# Altium schematic sheet 交通灯.SCHDOC
size A4
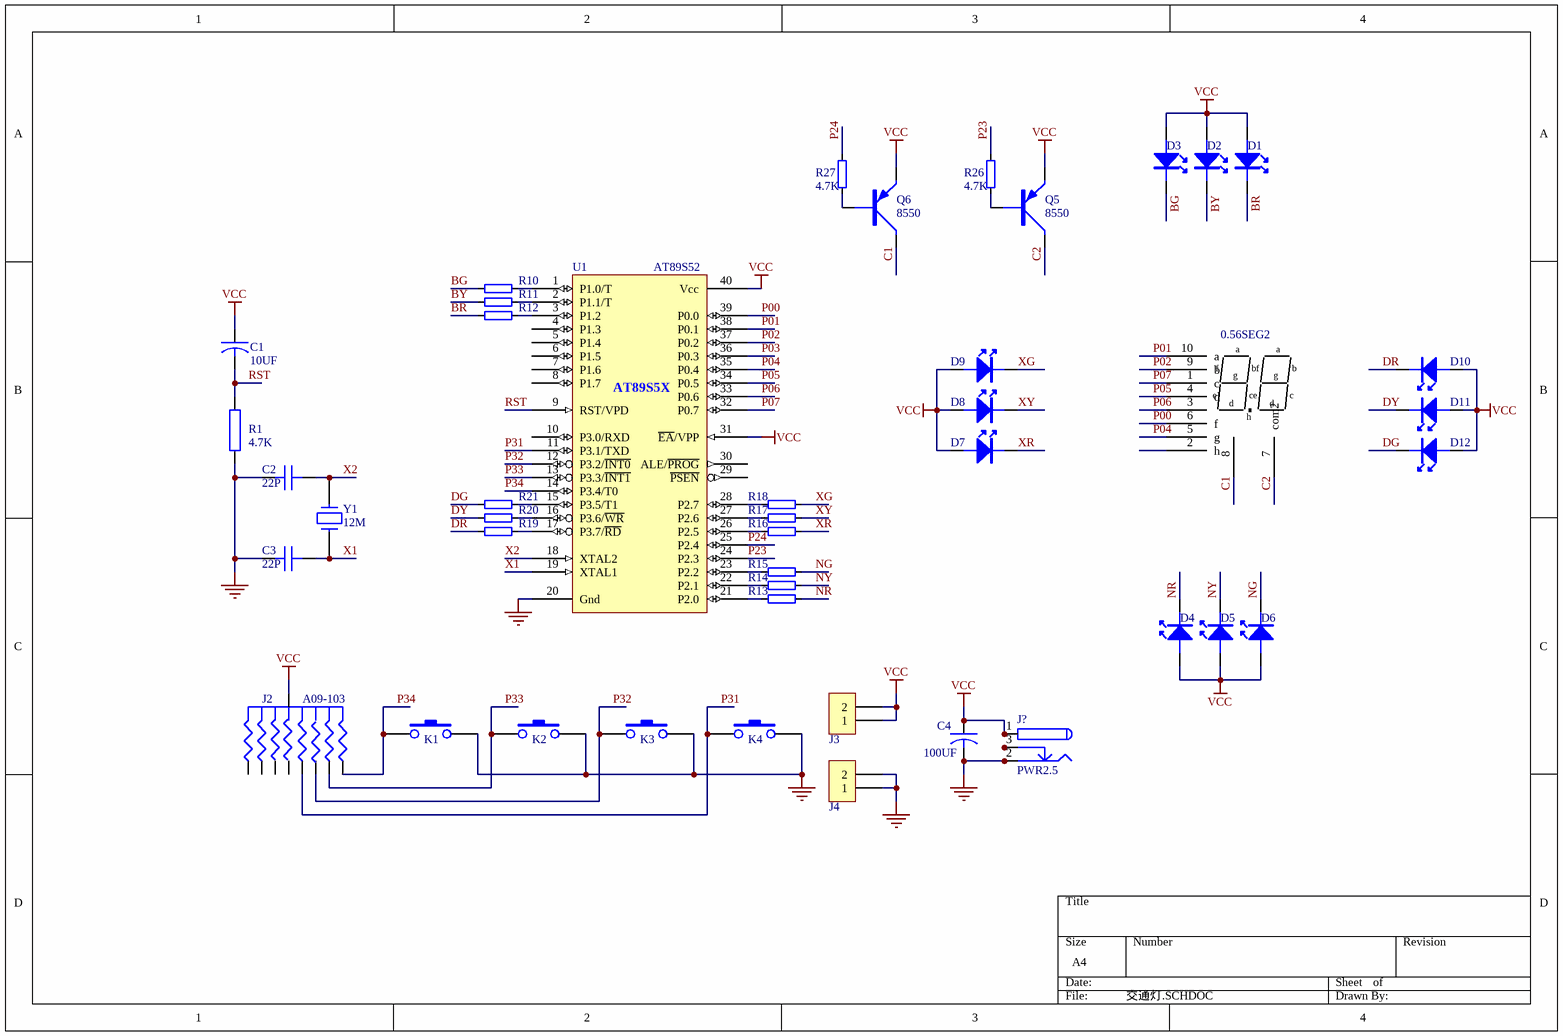
[diagram p0: 交通灯.SCHDOC]

## Parts
0.56SEG2  LED-2NUMBER  [LEDDIP-18ANUM]  (value not drawn)
C1  CAPACITOR  [CAPPA14.05-10.5x6.3]  (value not drawn)
C2  CAP  [CAPR5.08-7.8x3.2]  (value not drawn)
C3  CAP  [CAPR5.08-7.8x3.2]  (value not drawn)
C4  CAPACITOR  [CAPPA14.05-10.5x6.3]  (value not drawn)
D1  LED  [LED-0]  (value not drawn)
D2  LED  [LED-0]  (value not drawn)
D3  LED  [LED-0]  (value not drawn)
D4  LED  [LED-0]  (value not drawn)
D5  LED  [LED-0]  (value not drawn)
D6  LED  [LED-0]  (value not drawn)
D7  LED  [LED-0]  (value not drawn)
D8  LED  [LED-0]  (value not drawn)
D9  LED  [LED-0]  (value not drawn)
D10  LED  [LED-0]  (value not drawn)
D11  LED  [LED-0]  (value not drawn)
D12  LED  [LED-0]  (value not drawn)
J2  A09-103  [SIP9]
J3  CON2  [AXIAL-0.3]  (value not drawn)
J4  CON2  [AXIAL-0.3]  (value not drawn)
J?  PWR2.5  [KLD-0202]
K1  SW-PB  [SPST-2]  (value not drawn)
K2  SW-PB  [SPST-2]  (value not drawn)
K3  SW-PB  [SPST-2]  (value not drawn)
K4  SW-PB  [SPST-2]  (value not drawn)
Q5  8550  [BCY-W3]
Q6  8550  [BCY-W3]
R1  RES  [AXIAL-0.3]  (value not drawn)
R10  RES  [AXIAL-0.3]  (value not drawn)
R11  RES  [AXIAL-0.3]  (value not drawn)
R12  RES  [AXIAL-0.3]  (value not drawn)
R13  RES  [AXIAL-0.3]  (value not drawn)
R14  RES  [AXIAL-0.3]  (value not drawn)
R15  RES  [AXIAL-0.3]  (value not drawn)
R16  RES  [AXIAL-0.3]  (value not drawn)
R17  RES  [AXIAL-0.3]  (value not drawn)
R18  RES  [AXIAL-0.3]  (value not drawn)
R19  RES  [AXIAL-0.3]  (value not drawn)
R20  RES  [AXIAL-0.3]  (value not drawn)
R21  RES  [AXIAL-0.3]  (value not drawn)
R26  RES  [AXIAL-0.3]  (value not drawn)
R27  RES  [AXIAL-0.3]  (value not drawn)
U1  AT89S52  [DIP40]
Y1  CRYSTAL  [R38]  (value not drawn)

## Nets
GND: C2.1 C3.1 C4.2 J4.1 J4.2 J?.2 J?.2A J?.2B K1.2 K2.2 K3.2 K4.2 R1.1 U1.20(Gnd)
VCC: C1.1 C4.1 D1.1 D2.1 D3.1 D4.1 D5.1 D6.1 D7.1 D8.1 D9.1 D10.1 D11.1 D12.1 J2.1 J3.1 J3.2 J?.1 J?.1A J?.1B Q5.1(E) Q6.1(E) U1.31(~{EA}/VPP) U1.40(Vcc)
BG: D3.2 R10.1
BR: D1.2 R12.1
BY: D2.2 R11.1
C1: 0.56SEG2.8(com1) Q6.3(C)
C2: 0.56SEG2.7(com2) Q5.3(C)
DG: D12.2 R21.1
DR: D10.2 R19.1
DY: D11.2 R20.1
NG: D6.2 R15.2
NR: D4.2 R13.2
NY: D5.2 R14.2
P00: 0.56SEG2.6(f) U1.39(P0.0)
P01: 0.56SEG2.10(a) U1.38(P0.1)
P02: 0.56SEG2.9(b) U1.37(P0.2)
P03: U1.36(P0.3)
P04: 0.56SEG2.5(g) U1.35(P0.4)
P05: 0.56SEG2.4(d) U1.34(P0.5)
P06: 0.56SEG2.3(e) U1.33(P0.6)
P07: 0.56SEG2.1(c) U1.32(P0.7)
P23: R26.2 U1.24(P2.3)
P24: R27.2 U1.25(P2.4)
P31: J2.6 K4.1 U1.11(P3.1/TXD)
P32: J2.7 K3.1 U1.12(P3.2/~{INT0})
P33: J2.8 K2.1 U1.13(P3.3/~{INT1})
P34: J2.9 K1.1 U1.14(P3.4/T0)
RST: C1.2 R1.2 U1.9(RST/VPD)
X1: C3.2 U1.19(XTAL1) Y1.1
X2: C2.2 U1.18(XTAL2) Y1.2
XG: D9.2 R18.2
XR: D7.2 R16.2
XY: D8.2 R17.2
NetJ?_3: J?.3 J?.3A J?.3B
NetQ5_2: Q5.2(B) R26.1
NetQ6_2: Q6.2(B) R27.1
NetR10_2: R10.2 U1.1(P1.0/T)
NetR11_2: R11.2 U1.2(P1.1/T)
NetR12_2: R12.2 U1.3(P1.2)
NetR13_1: R13.1 U1.21(P2.0)
NetR14_1: R14.1 U1.22(P2.1)
NetR15_1: R15.1 U1.23(P2.2)
NetR16_1: R16.1 U1.26(P2.5)
NetR17_1: R17.1 U1.27(P2.6)
NetR18_1: R18.1 U1.28(P2.7)
NetR19_2: R19.2 U1.17(P3.7/~{RD})
NetR20_2: R20.2 U1.16(P3.6/~{WR})
NetR21_2: R21.2 U1.15(P3.5/T1)

Not connected (* = marked no-connect by the designer): 0.56SEG2 2(h); J2 2 3 4 5; U1 4(P1.3) 5(P1.4) 6(P1.5) 7(P1.6) 8(P1.7) 10(P3.0/RXD) 29(~{PSEN}) 30(ALE/~{PROG})

## Notes on the sheet
- (in symbol CAP) 22P
- (in symbol CAPACITOR) 10UF; 100UF
- (in symbol CRYSTAL) 12M
- (in symbol RES) 4.7K

## Library data of the parts
C2 C3 = CAP: Capacitor，电容
J2 = RES-ROW: 排阻
J3 J4 = CON2: Connector
J? = PWR2.5: Low Voltage Power Supply Connector; Published: 17-Dec-2003; DatasheetDocument: 09-May-2002; Publisher: Altium Limited
Q5 Q6 = 8550: PNP Transistor
U1 = AT89S5X
Y1 = CRYSTAL: Crystal，晶振; Text Field1: jjj